# EAGLE design Driver 1 (EAGLE 8.5.1)
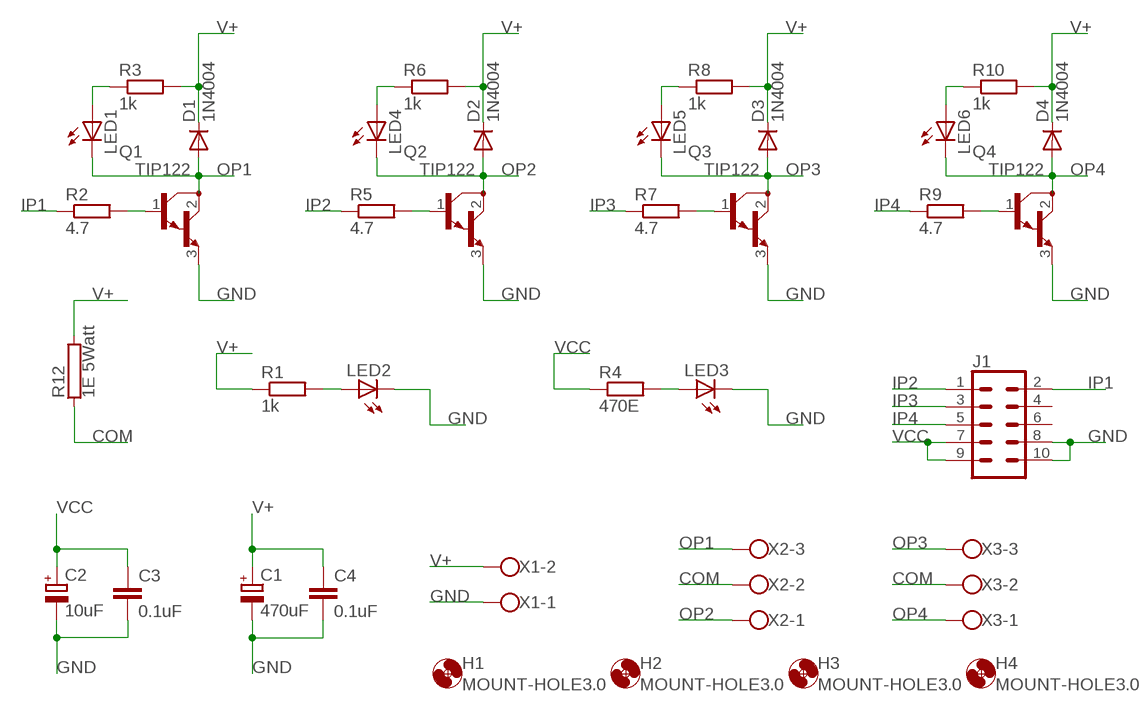
[diagram p0: schematic, sheet 1]

## Parts
C1  470uF  CPOL-EUE5-8.5  [E5-8,5]
C2  10uF  CPOL-EUE2-5  [E2-5]
C3  0.1uF  C-EU025-025X050  [C025-025X050]
C4  0.1uF  C-EU025-025X050  [C025-025X050]
D1  1N4004  [DO41-10]
D2  1N4004  [DO41-10]
D3  1N4004  [DO41-10]
D4  1N4004  [DO41-10]
H1  MOUNT-HOLE3.0  [3,0]
H2  MOUNT-HOLE3.0  [3,0]
H3  MOUNT-HOLE3.0  [3,0]
H4  MOUNT-HOLE3.0  [3,0]
J1  CONN_05X2RAF  [2X5-RAF]
LED1  LED5MM  [LED5MM]
LED2  LED5MM  [LED5MM]
LED3  LED5MM  [LED5MM]
LED4  LED5MM  [LED5MM]
LED5  LED5MM  [LED5MM]
LED6  LED5MM  [LED5MM]
Q1  TIP122  [TO220]
Q2  TIP122  [TO220]
Q3  TIP122  [TO220]
Q4  TIP122  [TO220]
R1  1k  R-EU_0207/10  [0207/10]
R2  4.7  R-EU_0207/10  [0207/10]
R3  1k  R-EU_0207/10  [0207/10]
R4  470E  R-EU_0207/10  [0207/10]
R5  4.7  R-EU_0207/10  [0207/10]
R6  1k  R-EU_0207/10  [0207/10]
R7  4.7  R-EU_0207/10  [0207/10]
R8  1k  R-EU_0207/10  [0207/10]
R9  4.7  R-EU_0207/10  [0207/10]
R10  1k  R-EU_0207/10  [0207/10]
R12  1E 5Watt  RKH208-8  [KH208-8]
X1  W237-102  [W237-102]
X2  W237-103  [W237-103]
X3  W237-103  [W237-103]

## Nets
COM: R12.1 X2.2 X3.2
GND: C1.- C2.- C3.2 C4.2 J1.8 J1.10 LED2.K(C) LED3.K(C) Q1.3(E) Q2.3(E) Q3.3(E) Q4.3(E) X1.1
IP1: J1.2 R2.1
IP2: J1.1 R5.1
IP3: J1.3 R7.1
IP4: J1.5 R9.1
N$1: LED2.A R1.2
N$2: LED1.A R3.1
N$4: Q1.1(B) R2.2
N$6: LED4.A R6.1
N$7: LED3.A R4.2
N$9: Q2.1(B) R5.2
N$11: LED5.A R8.1
N$13: Q3.1(B) R7.2
N$15: LED6.A R10.1
N$17: Q4.1(B) R9.2
OP1: D1.A LED1.K(C) Q1.2(C) X2.3
OP2: D2.A LED4.K(C) Q2.2(C) X2.1
OP3: D3.A LED5.K(C) Q3.2(C) X3.3
OP4: D4.A LED6.K(C) Q4.2(C) X3.1
V+: C1.+ C4.1 D1.C D2.C D3.C D4.C R1.1 R3.2 R6.2 R8.2 R10.2 R12.2 X1.2
VCC: C2.+ C3.1 J1.7 J1.9 R4.1
Unconnected: J1.4 J1.6

## Library data of the parts
C1 C2 = rcl:CPOL-EU: POLARIZED CAPACITOR, European symbol; SPICEPREFIX: C
C3 C4 = rcl:C-EU: CAPACITOR, European symbol; SPICEPREFIX: C
D1-D4 = adafruit:1N4004: DIODE General purpose 1N400x type rectifier (With bigger pads) http://www.ladyada.net/library/pcb/eaglelibrary.html
H1-H4 = holes:MOUNT-HOLE: MOUNTING HOLE with drill center marker
J1 = SparkFun-Connectors:CONN_05X2: Multi connection point. Often used as Generic Header-pin footprint for 0.1 inch spaced/style header connections For AVR SPI programming port, see special device with nice symbol: "AVR_SPI_PROG_5x2.dev" You can populate with any combo of single row headers, but if you'd like an exact match, check these: 2x5 AVR ICSP Male Header <https://www.sparkfun.com/products/778> (PRT-00778) 2x5 Pin Shrouded Header <https://www.sparkfun.com/products/8506> (PRT-08506) On any of the 0.1 inch spaced packages, you can populate with these: Break Away Headers - Straight <https://www.sparkfun.com/products/116> (PRT-00116) Break Away Male Headers - Right Angle <https://www.sparkfun.com/products/553> (PRT-00553) Female Headers <https://www.sparkfun.com/products/115> (PRT-00115) Break Away Headers - Machine Pin <https://www.sparkfun.com/products/117> (PRT-00117) Break Away Female Headers - Swiss Machine Pin <https://www.sparkfun.com/products/743> (PRT-00743) Special note: the shrouded connector mates well with our 5x2 ribbon cables: 2x5 Pin IDC Ribbon Cable <https://www.sparkfun.com/products/8535> (PRT-08535)
LED1-LED6 = adafruit:LED: LED OSRAM: - CHIPLED LG R971, LG N971, LY N971, LG Q971, LY Q971, LO R971, LY R971 LH N974, LH R974 LS Q976, LO Q976, LY Q976 LO Q996 - Hyper CHIPLED LW Q18S LB Q993, LB Q99A, LB R99A - SideLED LS A670, LO A670, LY A670, LG A670, LP A670 LB A673, LV A673, LT A673, LW A673 LH A674 LY A675 LS A676, LA A676, LO A676, LY A676, LW A676 LS A679, LY A679, LG A679 - Hyper Micro SIDELED® LS Y876, LA Y876, LO Y876, LY Y876 LT Y87S - SmartLED LW L88C, LW L88S LB L89C, LB L89S, LG L890 LS L89K, LO L89K, LY L89K LS L896, LA L896, LO L896, LY L896 - TOPLED LS T670, LO T670, LY T670, LG T670, LP T670 LSG T670, LSP T670, LSY T670, LOP T670, LYG T670 LG T671, LOG T671, LSG T671 LB T673, LV T673, LT T673, LW T673 LH T674 LS T676, LA T676, LO T676, LY T676, LB T676, LH T676, LSB T676, LW T676 LB T67C, LV T67C, LT T67C, LS T67K, LO T67K, LY T67K, LW E67C LS E67B, LA E67B, LO E67B, LY E67B, LB E67C, LV E67C, LT E67C LW T67C LS T679, LY T679, LG T679 LS T770, LO T770, LY T770, LG T770, LP T770 LB T773, LV T773, LT T773, LW T773 LH T774 LS E675, LA E675, LY E675, LS T675 LS T776, LA T776, LO T776, LY T776, LB T776 LHGB T686 LT T68C, LB T68C - Hyper Mini TOPLED® LB M676 - Mini TOPLED Santana® LG M470 LS M47K, LO M47K, LY M47K Source: http://www.osram.convergy.de/
Q1-Q4 = transistor-npn:TIP122*: NPN Darlington Transistor
R1-R10 = rcl:R-EU_: RESISTOR, European symbol; SPICEPREFIX: R
R12 = resistor-power:R: Power Resitor; OC_FARNELL: unknown; OC_NEWARK: unknown
X1 = con-wago-500:W237-102: WAGO SCREW CLAMP; MPN: 237-102; OC_FARNELL: unknown; OC_NEWARK: 70K9898
X2 X3 = con-wago-500:W237-103: WAGO SCREW CLAMP; MPN: 237-103; OC_FARNELL: unknown; OC_NEWARK: 18M7116

## Board
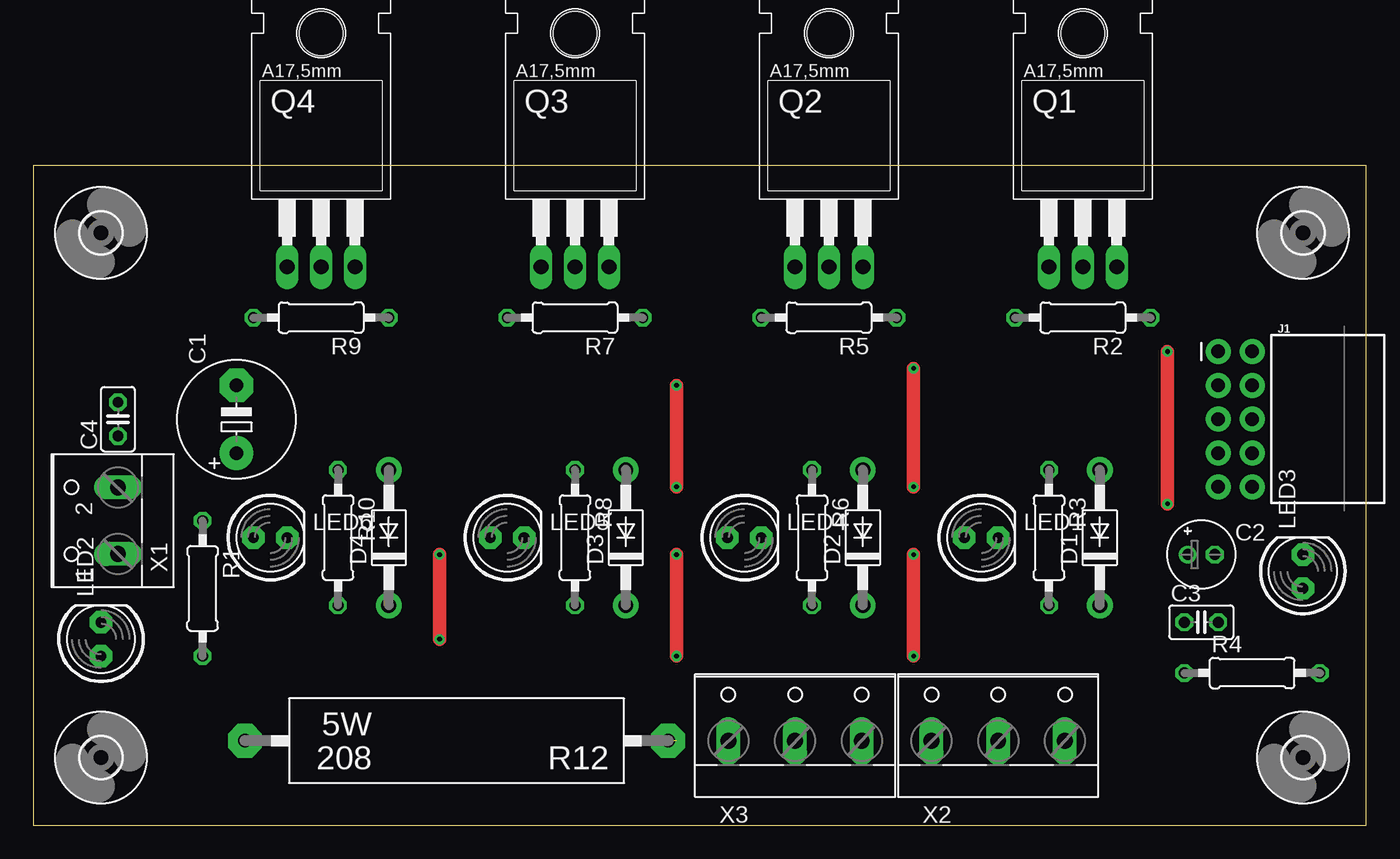
[diagram p1: board, top side]
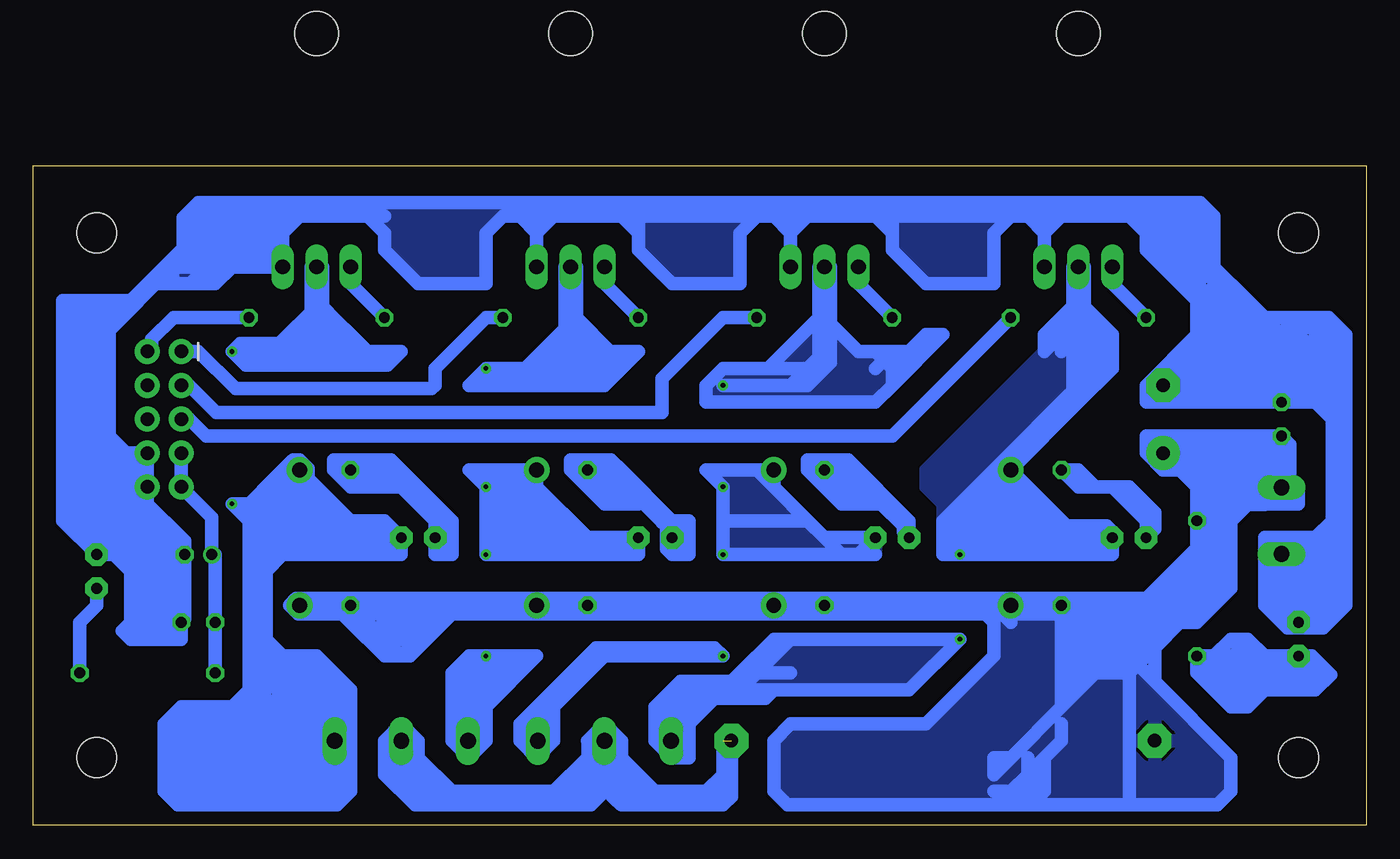
[diagram p2: board, bottom side, seen from below]

Size 100 x 49.52 mm. Coordinates in mm from the lower left corner, seen from the top.
Outline: 0,0 100,0 100,49.52 0,49.52 0,0
Copper layers (1*16): Top 0.035mm / dielectric 1.5mm / Bottom 0.035mm
Design rules "default *": minimum track width 6mil, minimum drill 0.35mm, track to track 30mil, track to pad 30mil, pad to pad 6mil, via to via 6mil, smd to smd 6mil, copper to edge 40mil, drill to drill 6mil, minimum pad ring 10mil, minimum via ring 8mil, stop-mask expansion 4mil, vias tented up to drill 0mil, thermal gap 10mil

### Footprints (pad centres in the part's own frame; a part is rotated, then mirrored left to right if it is on the bottom)
E5-8,5 = drill 1.016 pad 2.54: + -2.54,0 | drill 1.016 pad 2.54 octagon: - 2.54,0
E2-5 = drill 0.813 pad 1.27: + -1.016,0 | drill 0.813 pad 1.27 octagon: - 1.016,0
C025-025X050 = drill 0.813 octagon: 1 -1.27,0; 2 1.27,0
DO41-10 = drill 1.118 pad 1.93: A 5.08,0; C -5.08,0
3,0 = hole 3: 0,0
2X5-RAF = drill 1.016 pad 1.88: 1 -1.27,5.08; 2 1.27,5.08; 3 -1.27,2.54; 4 1.27,2.54; 5 -1.27,0; 6 1.27,0; 7 -1.27,-2.54; 8 1.27,-2.54; 9 -1.27,-5.08; 10 1.27,-5.08
LED5MM = drill 0.813 pad 1.676 octagon: A -1.27,0; K 1.27,0
TO220 = drill 1.118 long: 1 -2.54,-6.35; 2 0,-6.35; 3 2.54,-6.35 | hole 3.302: 0,11.176
0207/10 = drill 0.813 octagon: 1 -5.08,0; 2 5.08,0
KH208-8 = drill 1.016 pad 2.54 octagon: 1 -15.875,0; 2 15.875,0
W237-102 = drill 1.194 long: 1 -2.5,-1.27; 2 2.5,-1.27
W237-103 = drill 1.194 long: 1 -5,-1.29; 2 0,-1.29; 3 5,-1.29

### Placement (x,y rotation side)
C1  15.24,30.48 90 top
C2  87.63,20.32 0 top
C3  87.63,15.24 0 top
C4  6.35,30.48 90 top
D1  80.01,21.59 90 top
D2  62.23,21.59 90 top
D3  44.45,21.59 90 top
D4  26.67,21.59 90 top
H1  95.25,5.08 0 top
H2  5.08,44.45 0 top
H3  95.25,44.45 0 top
H4  5.08,5.08 0 top
J1  90.17,30.48 0 top
LED1  71.12,21.59 0 top
LED2  5.08,13.97 90 top
LED3  95.25,19.05 90 top
LED4  53.34,21.59 0 top
LED5  35.56,21.59 0 top
LED6  17.78,21.59 0 top
Q1  78.74,48.26 0 top
Q2  59.69,48.26 0 top
Q3  40.64,48.26 0 top
Q4  21.59,48.26 0 top
R1  12.7,17.78 270 top
R2  78.74,38.1 180 top
R3  76.2,21.59 270 top
R4  91.44,11.43 0 top
R5  59.69,38.1 180 top
R6  58.42,21.59 270 top
R7  40.64,38.1 180 top
R8  40.64,21.59 270 top
R9  21.59,38.1 180 top
R10  22.86,21.59 270 top
R12  31.75,6.35 180 top
X1  5.08,22.86 90 top
X2  72.39,7.62 0 top
X3  57.15,7.62 0 top

### Tracks (layer width: path | path; a pad name or v marks a point on that pad's centre or on a via)
COM  (1 unrouted)
  Bottom 1.016: 48.26,3.81 48.26,6.35 47.62,6.99 47.62,2.16 48.26,1.52 49.28,1.52 | 48.26,3.81 48.26,2.54 49.28,1.52 | 49.28,1.52 55.88,1.52 56.39,2.03 | 56.39,2.03 56.9,2.54 | 56.9,2.54 57.15,2.54 | 72.39,3.81 72.39,2.79 | 72.14,2.54 71.12,1.52 | 71.12,1.52 58.17,1.52 57.15,2.54 | 48.26,3.81 49.53,2.54 53.34,2.54 | 53.34,2.54 54.61,2.54 | 54.61,2.54 55.88,2.54 | 55.88,2.54 56.9,2.54 | 57.15,2.54 58.42,2.54 | 58.42,2.54 59.69,2.54 | 59.69,2.54 60.96,2.54 | 60.96,2.54 68.6,2.54 | 68.6,2.54 69.85,2.54 | 69.85,2.54 71.12,2.54 | 71.12,2.54 72.14,2.54 | 72.14,2.54 72.39,2.79 | 72.39,3.81 71.12,2.54 | 71.12,5.08 71.12,3.81 | 71.12,3.81 71.12,2.54 | 72.39,3.81 71.12,3.81 | 71.12,3.81 69.85,2.54 | X2.2 72.39,3.83 | X2.2 71.14,5.08 | 71.14,5.08 71.12,5.08 | 71.14,5.08 72.39,3.83 | 72.39,3.83 72.39,3.81 | X2.2 72.41,6.33 73.66,5.08 | 73.66,5.08 73.66,3.81 | 73.66,5.08 73.64,5.08 72.39,3.83 | 73.66,3.81 73.41,3.81 72.39,2.79 | X2.2 71.14,6.33 | 71.14,6.33 71.12,6.35 | 71.12,6.35 72.41,6.35 | 73.66,6.35 73.66,5.08 | 71.14,6.33 71.14,5.1 71.12,5.08 | 71.12,6.35 72.39,7.62 73.66,6.35 | X2.2 72.41,6.35 | 72.41,6.35 73.66,6.35 | 55.88,5.08 55.88,3.81 | 55.88,3.81 55.88,2.54 | X3.2 57.15,5.08 | 57.15,3.81 57.15,2.54 | 56.39,2.03 56.39,4.32 57.15,5.08 | X3.2 57.13,6.33 55.88,5.08 | 55.88,5.08 55.88,6.35 57.15,7.62 58.42,6.35 58.4,6.33 | 58.4,6.33 57.15,5.08 | X3.2 57.17,6.33 58.4,5.1 | 58.4,5.1 58.4,6.33 | 58.4,5.1 60.96,2.54 | X3.2 58.42,5.06 | 58.42,5.06 58.42,3.81 | 58.42,3.81 59.69,2.54 | 71.14,5.08 68.6,2.54 | 73.66,3.81 71.37,1.52 71.12,1.52 | 58.42,2.54 57.15,3.81 | 57.15,3.81 57.15,5.08 | 58.42,5.06 57.17,3.81 | 57.17,3.81 57.15,3.81 | 55.88,5.08 53.34,2.54 | 55.88,3.81 54.61,2.54 | 57.17,3.81 58.42,3.81
GND
  Bottom 1.016: 24.13,45.72 24.13,44.45 | 24.13,44.45 Q4.3 | 24.13,45.72 25.4,45.72 | 25.4,45.72 26.67,45.72 | 26.67,45.72 35.56,45.72 | 35.56,45.72 36.83,45.72 | 36.83,45.72 41.91,45.72 | 41.91,45.72 43.18,45.72 | 43.18,45.72 44.45,45.72 | 44.45,45.72 45.72,45.72 | 45.72,45.72 54.61,45.72 | 54.61,45.72 55.88,45.72 | 55.88,45.72 60.96,45.72 | 60.96,45.72 62.23,45.72 | 62.23,45.72 62.23,44.45 | 62.23,44.45 Q2.3 | Q3.3 43.18,44.45 | 43.18,44.45 43.18,45.72 | 81.28,45.72 80.01,45.72 | 74.93,45.72 80.01,45.72 | 63.5,45.72 64.77,45.72 66.04,44.45 66.04,40.64 71.12,40.64 73.66,43.18 73.66,44.45 74.93,45.72 | 63.5,45.72 62.23,45.72 | 86.99,41.91 86.36,41.91 | 86.36,41.91 85.09,41.91 | 85.09,41.91 82.55,41.91 | 82.55,41.91 Q1.3 81.28,43.18 | X1.1 5.08,19.09 | 5.08,19.09 3.77,19.09 | 3.77,19.09 2.54,20.32 | 2.54,21.59 2.54,22.86 | 2.54,22.86 2.54,30.48 | 2.54,30.48 2.54,31.75 | 2.54,33.02 2.54,34.04 | 2.54,34.29 2.54,35.56 | 2.54,35.56 2.54,36.83 3.81,34.29 | 2.54,33.02 2.54,31.75 | 5.08,17.82 5.08,19.09 | 3.77,19.09 4.45,18.41 4.48,18.41 5.08,17.82 | 5.08,17.82 X1.1 | 6.35,17.78 7.62,17.78 | 7.62,21.59 6.35,21.59 | 6.35,21.59 3.81,21.59 | 3.81,21.59 3.17,20.95 | 3.17,20.95 2.54,20.32 | 2.54,20.32 2.54,21.59 | X1.1 5.04,19.09 2.54,20.32 | X1.1 6.35,21.59 | 7.62,17.82 7.62,19.05 | 7.62,19.05 7.62,21.59 | X1.1 7.58,19.09 7.62,19.05 | X1.1 6.35,17.78 | X1.1 7.62,17.82 | 7.62,17.82 7.62,17.78 | X1.1 6.39,19.09 7.62,21.59 | X1.1 6.31,19.09 5.08,20.32 | 5.08,20.32 3.81,21.59 | 2.54,20.32 1.52,21.34 | 1.52,34.54 1.91,34.92 | 1.52,34.54 2.54,33.02 | 1.52,21.34 1.52,34.54 | 11.43,39.37 10.16,36.83 | 10.16,36.83 8.89,34.29 | 8.89,34.29 6.98,34.92 | 6.98,34.92 7.62,33.02 | 11.43,39.37 11.43,40.64 | 11.43,44.45 11.43,45.72
  Bottom 1.016: 11.43,45.72 12.7,45.72 | 12.7,45.72 13.97,45.72 | 13.97,45.72 15.24,45.72 | 15.24,45.72 16.51,45.72 | 16.51,45.72 17.78,45.72 | 17.78,45.72 22.86,45.72 | 22.86,45.72 24.13,45.72 | 11.43,45.72 12.44,46.73 80.27,46.73 | 80.27,46.73 81.28,45.72 | 81.28,45.72 82.55,44.45 | 82.55,44.45 82.55,43.18 | 82.55,43.18 82.55,42.55 | 82.55,42.55 82.55,41.91 | 81.28,43.18 81.28,44.45 | 81.28,44.45 81.28,45.72 | 81.91,43.81 81.28,43.18 | 82.55,41.91 81.91,42.55 | 81.91,42.55 81.28,43.18 | 81.28,44.45 81.91,43.81 | 81.91,43.81 81.91,42.55 | 80.01,45.72 81.28,44.45 | 62.23,44.45 63.5,45.72 | 62.23,44.45 60.96,45.72 | 43.18,44.45 44.45,45.72 | 43.18,44.45 41.91,45.72 | 24.13,44.45 25.4,45.72 | 24.13,44.45 22.86,45.72 | 12.7,45.72 12.7,44.45 | 3.81,34.29 2.54,31.75 | 12.7,36.83 12.7,35.56 | 10.16,34.29 8.89,34.29 | 3.81,34.29 2.54,34.29 | 10.16,35.56 8.89,34.29 | 6.98,32.38 C4.2 | 7.62,33.02 8.89,33.02 | 12.06,33.66 12.7,34.29 | 6.98,32.38 10.79,32.38 | 10.79,32.38 11.43,33.02 | 10.16,34.29 9.53,33.66 | 9.53,33.66 8.89,33.02 | 10.16,34.29 11.43,34.29 | 8.89,33.02 11.43,33.02 | 11.43,33.02 10.16,34.29 | 9.53,33.66 12.06,33.66 | 5.71,33.66 4.45,32.38 | 4.45,32.38 3.81,31.75 | 3.81,31.75 2.54,30.48 | 5.08,34.29 2.54,31.75 | 11.43,35.56 10.16,34.29 | 3.81,35.56 3.17,34.92 | 3.17,34.92 2.54,34.29 | 7.62,34.29 8.89,35.56 | 8.89,35.56 7.62,35.56 | 7.62,35.56 6.35,34.29 | 5.08,34.29 3.81,35.56 | 5.71,34.92 3.17,34.92 | 2.54,33.02 3.17,34.92 | 3.17,34.92 3.81,34.29 | 7.62,33.02 7.62,34.29 | 6.35,34.29 5.08,34.29 | 5.08,34.29 2.54,33.02 | 6.98,32.38 7.62,33.02 | 3.81,34.29 5.71,33.66 | 5.71,33.66 6.35,34.29 | 2.54,35.56 3.81,36.83 | 3.81,35.56 3.81,34.29 | 3.81,35.56 5.08,36.83 | 5.08,36.83 3.81,34.29 | 3.81,35.56 3.81,36.83
  Bottom 1.016: 5.08,35.56 6.35,36.83 C4.2 | 6.35,35.56 7.62,36.83 | 7.62,35.56 8.89,33.02 | 8.89,34.29 9.53,33.66 | 7.62,35.56 7.62,36.83 | 7.62,36.83 8.89,34.29 | 5.08,36.83 7.62,36.83 | 5.08,36.83 6.05,32.95 | 6.05,32.95 C4.2 | C4.2 8.89,33.02 | 7.62,36.83 C4.2 | 7.62,35.56 8.89,36.83 | 8.89,36.83 11.43,33.02 | 11.43,33.02 11.43,34.29 | 11.43,34.29 9.53,33.66 | 8.89,35.56 8.89,36.83 | 8.89,35.56 8.89,34.29 | 8.89,34.29 12.7,35.56 | 11.43,33.02 12.06,33.66 | 8.89,36.83 10.16,36.83 | 10.16,36.83 11.18,36.32 | 11.18,36.32 12.7,35.56 | 10.16,35.56 12.7,34.29 | 12.7,34.29 11.43,34.29 | 11.43,34.29 8.89,35.56 | 8.89,35.56 11.43,35.56 | 11.43,35.56 12.7,36.83 | 12.7,39.37 12.7,40.64 | 12.7,40.64 12.7,41.91 | 12.7,41.91 12.7,43.18 | 12.7,43.18 12.06,43.81 | 12.06,43.81 11.43,44.45 | 11.43,44.45 11.43,41.91 | 11.43,41.91 11.43,40.64 | 11.43,39.37 11.94,38.35 | 11.94,38.35 12.7,36.83 | 11.43,41.91 12.7,40.64 | 12.06,43.81 12.06,42.55 | 12.06,42.55 12.7,41.91 | 11.43,45.72 12.7,44.45 | 16.51,44.45 16.51,43.18 12.7,39.37 | 16.51,44.45 16.51,45.72 | 16.51,44.45 13.33,41.27 | 13.33,41.27 12.7,40.64 | 13.33,41.27 13.33,42.55 16.51,45.72 | 15.24,45.72 13.97,44.45 | 13.97,44.45 12.7,44.45 | 13.97,45.72 12.7,44.45 | 13.97,44.45 12.7,43.18 | 26.67,45.72 27.94,44.45 27.94,40.64 33.02,40.64 35.56,43.18 35.56,44.45 | 35.56,44.45 35.56,45.72 | 45.72,45.72 46.99,44.45 46.99,40.64 52.07,40.64 54.61,43.18 54.61,44.45 | 54.61,44.45 54.61,45.72 | 80.27,46.73 87.63,46.73 88.77,45.59 | 74.93,45.72 73.66,45.72 | 54.61,44.45 55.88,45.72 | 35.56,44.45 36.83,45.72 | 16.51,44.45 17.78,45.72 | 87.63,45.72 88.77,45.59 | J1.8 91.44,26.67 | 91.44,26.67 J1.10 | 91.44,24.13 88.9,21.59 | 88.9,21.59 88.65,21.34 C2.- 88.65,19.05
  Bottom 1.016: 88.65,19.05 88.65,15.49 C3.2 | 88.9,13.97 C3.2 | 92.71,15.24 93.34,14.61 | 92.71,15.24 92.71,16.51 | 92.71,16.51 92.71,17.78 | 92.71,17.78 92.71,19.05 | 92.71,20.32 92.71,19.05 | 92.71,19.05 93.98,20.32 | 93.98,20.32 LED3.K | 1.91,34.92 3.81,34.29 | 3.81,34.29 5.08,34.29 | 6.35,34.29 7.62,34.29 | 7.62,34.29 8.89,34.29 | 6.98,34.92 5.71,34.92 | 94.3,35.88 94.93,35.24 | 94.93,35.24 97.47,32.7 | 97.47,32.7 97.79,32.38 | 97.79,38.1 97.79,36.83 | 97.79,36.83 97.79,35.88 | 93.34,38.1 93.98,38.1 | 93.98,38.1 97.79,38.1 | 90.49,40.96 89.53,41.91 89.53,40.64 90.8,40.64 | 90.49,40.96 90.8,40.64 | 90.8,40.64 93.34,38.1 | 86.99,41.91 87.95,40.96 86.68,40.96 86.36,40.64 | 85.09,41.91 86.36,40.64 | 86.36,41.91 86.36,40.64 | 94.3,35.88 94.3,29.21 93.03,27.94 J1.8 | 86.36,40.64 90.17,40.64 90.49,40.96 | 90.49,40.96 91.12,40.96 | 91.12,40.96 92.71,39.37 | 92.71,39.37 93.34,38.73 | 93.34,38.73 93.98,38.1 | 97.79,38.1 97.79,39.37 92.71,39.37 | 93.34,38.1 94.3,37.15 | 94.3,37.15 94.3,35.88 | 81.28,45.72 82.55,45.72 | 82.55,45.72 87.63,45.72 | 87.63,45.72 88.27,45.09 | 88.27,45.09 87.63,43.18 | 87.63,43.18 88.9,43.18 | 88.9,43.18 88.9,41.91 86.99,41.91 | 82.55,44.45 83.19,45.09 88.27,45.09 | 88.27,45.09 87.63,44.45 | 87.63,44.45 86.99,43.81 | 81.91,43.81 82.55,44.45 | 82.55,44.45 87.63,44.45 | 86.99,43.81 86.36,43.81 | 86.36,43.81 85.09,43.81 | 85.09,43.81 83.82,43.81 | 83.82,43.81 83.19,43.81 82.55,43.18 | 81.91,42.55 82.55,42.55 | 82.55,42.55 83.82,42.55 | 83.82,42.55 85.09,42.55 | 85.09,42.55 86.99,42.55 | 86.99,42.55 88.27,42.55 88.9,43.18 | 83.82,43.81 82.55,42.55 | 83.82,42.55 85.09,43.81 | 86.36,43.81 86.04,43.5 | 86.04,43.5 85.09,42.55 | 87.63,43.18 86.99,42.55 | 86.36,43.81 86.99,43.18 86.99,42.55
  Bottom 1.016: 91.12,40.96 88.9,43.18 | 93.34,38.73 97.16,38.73 97.79,38.1 | LED3.K 97.79,22.86 97.79,24.13 | 97.79,32.38 97.79,30.48 | 97.79,30.48 97.79,29.21 | 97.79,26.67 97.79,24.13 | 87.63,43.18 88.7,44.45 88.07,43.81 86.99,43.81 | 88.77,45.59 88.77,43.31 88.9,43.18 | 91.44,13.97 92.71,13.97 93.34,14.61 | 91.44,13.97 90.17,13.97 | 90.17,13.97 88.9,13.97 | 1.52,34.54 1.52,35.31 | 1.91,34.92 1.52,35.31 | 1.52,35.31 1.52,35.56 | 1.52,35.56 2.54,35.56 | 8.89,36.83 10.81,40.28 | 10.81,40.28 12.06,42.55 | 2.54,35.56 3.81,35.56 | 3.81,35.56 5.08,35.56 | 11.43,40.64 8.89,35.56 | 7.62,35.56 6.35,35.56 | 5.08,35.56 3.81,34.29 | 1.52,35.56 2.54,34.04 | 2.54,34.04 2.54,34.29 | 1.52,35.56 3.3,37.34 | 3.3,37.34 3.81,37.85 3.81,36.83 | 7.62,34.29 6.98,37.47 | 6.98,37.47 6.35,35.56 | 6.35,35.56 5.08,35.56 | 5.08,34.29 5.71,34.92 | 5.71,34.92 6.35,35.56 | 6.98,37.47 6.6,36.7 | 6.6,36.7 5.71,34.92 | 94.3,37.15 95.25,37.15 | 95.25,37.15 96.52,37.15 | 96.52,37.15 97.47,37.15 97.79,36.83 | 96.52,37.15 97.79,35.88 | 97.79,35.88 97.79,35.56 | 97.79,35.56 97.79,34.29 | 97.79,34.29 97.79,32.38 | 95.25,37.15 95.25,35.24 | 95.25,35.24 95.25,33.02 | 95.25,26.67 95.25,25.4 | 95.25,24.13 95.25,22.86 | 95.25,22.86 95.25,21.59 | 95.25,21.59 LED3.K | 96.52,22.86 95.25,21.59 | 95.25,37.15 95.41,36.99 | 95.41,36.99 96.84,35.56 97.79,35.56 | 94.93,35.24 95.25,35.24 | 95.25,35.24 96.84,35.24 97.16,34.92 | 97.16,34.92 97.79,34.29 | 97.47,32.7 97.47,33.02 96.36,34.13 | 96.36,34.13 95.25,35.24 | 95.25,35.24 95.41,35.4 95.41,36.99 | 96.52,37.15 96.52,33.02 | 96.52,33.02 96.52,31.75 | 96.52,31.75 96.52,30.48 | 96.52,24.13 96.52,22.86 | 95.25,33.02 96.36,34.13 | 97.16,34.92 97.16,31.11 96.52,30.48 | 97.79,29.21 97.16,29.84
  Bottom 1.016: 97.16,29.84 96.52,30.48 | 96.52,30.48 96.52,29.21 | 96.52,29.21 96.52,27.94 | 96.52,27.94 96.52,25.4 | 96.52,25.4 96.52,24.13 | 96.52,24.13 95.25,22.86 | 95.25,33.02 95.25,31.75 | 95.25,31.75 95.25,30.48 | 95.25,30.48 95.25,29.21 | 95.25,29.21 95.25,27.94 | 95.25,27.94 95.25,26.67 | 95.25,26.67 95.88,26.04 | 95.88,26.04 96.52,25.4 | 96.52,33.02 95.25,31.75 | 96.52,30.48 95.25,29.21 | 96.52,31.75 95.25,30.48 | 96.52,27.94 95.88,27.3 | 95.88,27.3 95.25,26.67 | 96.52,29.21 95.25,27.94 | 97.79,29.21 97.79,26.67 | 97.79,26.67 97.16,26.04 | 96.52,25.4 95.25,24.13 | 97.16,29.84 97.16,26.04 | 97.16,26.04 96.52,25.4 | 97.79,24.13 96.52,22.86 | 97.16,26.04 97.16,24.77 | 97.16,24.77 96.52,24.13 | 95.25,29.21 93.34,27.3 | 93.34,27.3 92.71,26.67 | 92.71,26.67 91.44,26.67 | J1.8 92.08,27.3 | 92.08,27.3 92.71,26.67 | 95.25,27.94 92.71,25.4 | 92.71,25.4 J1.10 | 92.71,26.67 J1.10 | J1.10 91.44,24.13 | 95.25,26.67 92.71,24.13 | 92.71,24.13 91.44,24.13 | J1.10 92.71,24.13 | 92.71,24.13 90.17,21.59 | 90.17,21.59 88.9,21.59 | 95.25,25.4 95.25,24.13 | 95.25,24.13 92.71,21.59 | 92.71,21.59 91.44,21.59 | 91.44,21.59 90.17,21.59 | 95.25,25.4 91.44,21.59 | 95.25,22.86 93.34,20.95 | 93.34,20.95 92.71,20.32 | 95.25,21.59 93.98,20.32 | 92.71,20.32 91.44,21.59 | 91.44,21.59 90.17,20.32 | 90.17,20.32 88.9,20.32 | 88.9,20.32 88.9,19.05 | 88.9,19.05 88.65,19.05 | 90.17,21.59 88.9,20.32 | 88.9,19.05 88.9,17.78 | 90.17,20.32 90.17,19.05 | 90.17,19.05 90.17,17.78 | 90.17,17.78 90.17,15.24 | 90.17,15.24 90.17,13.97 | 88.9,13.97 90.17,15.24 | C3.2 88.9,16.51 | 88.9,16.51 88.9,17.78 | 88.9,17.78 90.17,19.05 | 90.17,20.32 88.9,19.05 | 90.17,17.78 88.9,16.51 | 92.71,20.32 91.44,20.32 | 91.44,20.32 90.17,19.05 | 92.71,20.32 90.17,17.78
  Bottom 1.016: 92.71,19.05 C3.2 | 92.71,17.78 90.17,15.24 | 92.71,16.51 91.44,15.24 | 91.44,15.24 90.17,15.24 | 93.34,14.61 92.08,14.61 91.44,15.24 | 92.71,15.24 91.44,15.24 | 91.44,15.24 90.17,13.97 | 91.44,13.97 91.44,15.24 | 91.44,20.32 91.44,21.59 | 92.71,21.59 93.34,20.95 | 92.71,24.13 92.71,25.4 | 96.52,24.13 95.25,25.4 | 97.79,24.13 97.16,24.77 | 95.88,27.3 95.88,26.04 | 92.08,27.3 93.34,27.3 | 97.16,29.84 97.79,30.48 | 97.79,30.48 96.52,30.48 | 87.63,43.18 86.36,43.18 86.04,43.5 | 82.55,44.45 82.55,45.72 | 12.7,40.64 11.43,39.37 | 3.17,34.92 5.71,33.66 | C4.2 3.81,31.75 | 4.45,32.38 5.49,32.38 6.05,32.95 | 1.52,35.56 1.52,36.83 2.79,38.1 7.62,38.1 12.7,43.18 | 12.7,43.18 12.7,44.45 | 3.3,37.34 5.97,37.34 6.6,36.7 | 7.62,36.83 8.89,38.1 | 8.89,38.1 10.81,40.02 10.81,40.28 | 6.6,36.7 8,38.1 8.89,38.1 | 12.7,39.37 11.18,37.85 11.18,36.32 | 12.7,36.83 10.16,36.83 | 10.16,35.56 11.94,37.34 11.94,38.35 | 12.7,39.37 12.7,36.83 | 12.7,35.56 13.97,34.29 | 13.97,34.29 12.7,34.29 | 12.7,36.83 16.51,33.02 | 16.51,33.02 16.51,31.75 | 16.51,31.75 13.97,31.75 | 13.97,31.75 12.7,31.75 | 12.7,31.75 C4.2 | 1.52,21.34 1.52,16.51 2.54,15.49 | 2.54,15.49 3.23,14.81 5.08,14.81 | 7.62,17.78 7.62,16.51 5.92,14.81 5.08,14.81 | 3.81,21.59 2.54,21.59 | 5.08,17.82 5.12,17.78 6.35,17.78 | 3.17,20.95 3.81,20.32 5.08,20.32 | 6.35,21.59 5.08,20.32 | 7.62,17.82 6.33,16.53 | 6.33,16.53 5.08,15.28 | 5.08,15.28 5.08,14.81 | 2.54,20.32 2.54,19.05 | 2.54,19.05 2.54,17.78 | 2.54,17.78 2.54,16.51 | 2.54,16.51 2.54,15.49 | 2.54,16.51 3.77,15.28 3.85,15.28 | 3.85,15.28 5.08,15.28 | 6.33,16.53 5.06,16.53 2.54,19.05 | 6.35,17.78 5.71,17.14 | 5.71,17.14 3.85,15.28 | LED2.K 2.54,17.78 | 5.08,17.82 5.08,17.78 5.71,17.14
  Bottom 1.016: 3.81,21.59 2.54,22.86 | 16.51,33.02 C1.- | 13.97,33.02 C1.- | C1.- 13.97,31.75 | C1.- 16.51,31.75 | C1.- 13.97,34.29 | C1.- 12.7,33.02 | 12.7,33.02 11.43,33.02 | 12.7,31.75 12.7,33.02 | 12.7,33.02 12.7,34.29 | 10.79,32.38 13.33,32.38 13.97,31.75 | 13.97,31.75 13.97,34.29 | 12.7,33.02 13.97,34.29 | 12.7,34.29 12.7,35.56
  pour Bottom: 35.56,45.72 35.56,44.45 31.75,40.64 29.21,40.64 27.94,41.91 27.94,45.72
  pour Bottom: 46.99,44.45 46.99,45.72 54.61,45.72 54.61,43.18 53.34,41.91 52.07,40.64 46.99,40.64
  pour Bottom: 64.77,45.72 73.66,45.72 73.66,44.45 69.85,40.64 66.04,40.64 66.04,44.45
  pour Bottom: 80.01,45.72 81.28,44.45 82.55,44.45 82.55,41.91 87.63,41.91 88.9,40.64 87.63,45.72
IP1
  Bottom 1.016: J1.2 91.11,35.89 91.11,36.48 89.48,38.1 R2.1
IP2
  Bottom 1.016: R5.1 66.04,38.1 69.85,34.29 69.85,33.02 70.1,32.77 84.84,32.77 87.63,35.56 J1.1
IP3
  Bottom 1.016: R7.1 48.26,38.1 52.83,33.53 52.83,30.99 86.28,30.99 88.31,33.02 J1.3
IP4
  Bottom 1.016: R9.1 35.56,29.21 87.05,29.21 88.31,30.48 J1.5
N$1
  Bottom 1.016: 11.43,12.7 R1.2 12.7,11.43 | 11.43,12.7 10.16,12.7 | 10.16,12.7 8.89,12.7 | 6.35,12.7 LED2.A | 3.81,11.43 5.08,11.43 | 5.08,11.43 7.62,11.43 | 8.89,11.43 10.16,11.43 | 10.16,11.43 11.43,11.43 | LED2.A 3.81,11.43 | 8.89,12.7 8.26,12.06 | 8.26,12.06 7.62,11.43 | 10.16,12.7 8.89,11.43 | 11.43,12.7 10.16,11.43 | 11.43,12.7 11.43,11.43 | 12.7,11.43 11.43,12.7 | 8.89,12.7 7.62,12.7 | 7.62,12.7 6.35,12.7 | 6.35,12.7 5.71,12.06 | 5.71,12.06 5.08,11.43 | 8.89,11.43 7.62,11.43 | 7.62,11.43 6.35,12.7 | 5.71,12.06 8.26,12.06 | 12.7,11.43 11.43,11.43 | 7.62,10.16 3.81,10.16 2.67,11.3 4.06,12.7 LED2.A | 7.62,10.16 8.89,8.89 | 8.89,8.89 10.16,8.89 | 10.16,8.89 12.7,11.43 | 11.43,11.43 8.89,8.89 | 10.16,11.43 9.53,10.79 | 9.53,10.79 8.89,10.16 | 8.89,10.16 7.62,10.16 | 10.16,8.89 8.89,10.16 | 8.89,10.16 8.89,11.43 | 9.53,10.79 4.45,10.79 3.81,11.43 | 11.43,12.7 10.16,13.97 | 10.16,13.97 8.89,13.97 7.62,12.7 | 10.16,13.97 8.89,12.7
N$2
  Bottom 1.016: R3.1 77.47,26.67 | 72.39,25.4 69.85,22.86 | 77.47,26.67 76.2,25.4 74.93,25.4 | 73.66,25.4 72.39,25.4 | 77.47,26.67 77.47,27.43 74.93,27.43 | 74.93,27.43 74.42,27.43 | 74.42,27.43 72.39,25.4 | 68.58,21.59 68.58,22.86 73.15,27.43 74.42,27.43 | 69.85,22.86 68.58,21.59 | R3.1 74.93,25.4 | 74.93,25.4 73.66,25.4 | 74.93,27.43 74.55,27.05 | 74.55,27.05 73.66,26.16 73.66,25.4 | R3.1 74.93,26.67 | 74.93,25.4 74.55,25.78 74.55,27.05 | 68.58,20.32 68.58,21.59 | 69.85,22.86 LED1.A | LED1.A 68.58,20.32 | 68.58,20.32 69.85,20.32 LED1.A
N$4
  Bottom 1.016: R2.2 76.2,40.64 Q1.1
N$6
  Bottom 1.016: LED4.A 52.5,22.02 | 52.5,22.02 52.5,22.46 52.9,22.86 | 54.39,24.35 55.66,25.62 | 55.66,25.62 56.71,26.67 | 56.71,26.67 R6.1 | LED4.A 50.8,22.86 | 55.88,26.67 56.71,26.67 | R6.1 58.42,25.4 | 58.42,25.4 57.15,24.13 55.88,24.13 | 55.88,24.13 54.61,24.13 54.39,24.35 | 58.42,25.4 59.69,26.67 | 59.69,26.67 59.69,27.43 56.64,27.43 55.88,26.67 | R6.1 59.69,26.67 | R6.1 56.71,24.96 | 56.71,26.67 56.71,24.96 | 56.71,24.96 56.52,24.77 | 56.52,24.77 55.88,24.13 | 55.66,25.62 56.52,24.77 | 55.66,25.62 55.66,24.35 55.88,24.13 | LED4.A 52.07,20.32 | 52.07,20.32 52.5,20.75 52.5,21.59 | 52.5,21.59 52.5,22.02 | 50.8,20.32 50.8,22.86 | 52.07,20.32 50.8,20.32 | LED4.A 52.5,21.59 | LED4.A 50.8,20.32 | 50.8,22.86 52.07,22.86 | 52.07,22.86 52.9,22.86 | 52.9,22.86 54.39,24.35 | 52.07,22.86 55.88,26.67
N$7
  Bottom 1.016: LED3.A 95.25,16.51 96.52,15.24 R4.2
N$9
  Bottom 1.016: R5.2 57.15,40.64 Q2.1
N$11
  Bottom 1.016: 36.39,24.13 37.24,24.99 | 37.24,24.99 38.51,26.26 | 38.51,26.26 38.93,26.67 R8.1 | R8.1 40.64,27.43 | 40.64,27.43 38.86,27.43 34.29,22.86 LED5.A 34.72,22.02 34.72,22.46 36.39,24.13 | 41.5,26.26 41.91,26.67 | 41.91,26.67 41.91,27.43 40.64,27.43 | 41.91,26.67 R8.1 | 38.51,26.26 39.37,26.26 | 39.37,26.26 41.5,26.26 | 41.5,26.26 39.37,24.13 38.1,24.13 | 38.1,24.13 36.39,24.13 | R8.1 38.1,24.13 | 39.37,26.26 38.1,24.99 37.24,24.99
N$13
  Bottom 1.016: R7.2 38.1,40.64 Q3.1
N$15
  Bottom 1.016: 19.05,25.4 17.78,25.4 15.88,23.5 15.88,22.23 LED6.A 16.51,22.86 19.05,25.4 | 20.32,25.4 21.59,26.67 R10.1 21.59,25.4 20.32,25.4 | 20.32,25.4 19.05,25.4
N$17
  Bottom 1.016: R9.2 19.05,40.64 Q4.1
OP1  (via drill 0.35)
  Top 1.016: v85.09,35.56 v85.09,24.13
  Bottom 1.016: X2.3 77.39,7.54 | D1.A 80.01,25.4 | 80.01,25.4 80.64,24.77 | 80.64,24.77 81.28,24.13 | 81.28,24.13 82.55,24.13 | 82.55,24.13 83.82,24.13 | 83.82,24.13 v85.09,24.13 84.45,23.5 | D1.A 79.38,26.04 | 79.38,26.04 78.74,25.4 | 78.74,25.4 76.2,22.86 | 76.2,22.86 75.56,22.23 | 75.56,22.23 74.93,21.59 | 73.66,21.59 74.93,21.59 | 77.39,7.54 77.47,7.54 | 77.47,7.54 78.74,7.62 | 78.74,7.62 79.38,8.26 | 79.38,8.26 80.01,8.89 | 80.01,8.89 80.64,9.53 | 78.74,12.7 76.2,10.16 76.2,8.89 | 76.2,8.89 76.2,7.62 | 76.2,7.62 76.2,6.35 | 76.2,6.35 76.2,5.08 | 76.2,5.08 77.47,5.08 | 77.47,5.08 78.74,5.08 | 78.74,5.08 78.74,6.35 | 78.74,6.35 78.74,7.62 | 83.82,24.13 81.91,26.04 | 81.91,26.04 81.28,26.67 | 81.28,26.67 80.64,27.3 | 80.64,27.3 80.52,27.43 80.01,27.43 79.38,26.8 79.38,26.04 | 72.39,20.32 LED1.K 73.66,22.86 | 74.93,20.32 76.2,20.32 | 76.2,20.32 78.74,20.32 | 78.74,20.32 80.01,20.32 | 80.01,20.32 81.28,20.32 | 73.66,22.86 73.66,21.59 | 72.39,20.32 73.66,21.59 | 81.28,26.67 80.01,25.4 | D1.A 80.64,27.3 | X2.3 78.74,7.68 | 78.74,7.68 78.74,8.81 | 78.74,7.68 78.74,7.62 | 78.74,6.35 77.47,5.08 | X2.3 77.39,6.43 76.2,7.62 | 76.2,7.62 77.31,7.62 | 77.31,7.62 77.39,7.54 | 76.2,8.89 77.31,7.78 77.31,7.62 | 78.74,8.81 78.74,8.89 83.19,13.34 | 78.74,8.81 77.47,7.54 | X2.3 77.39,5.16 77.47,5.08 | X2.3 76.22,6.33 76.2,6.35 | X2.3 77.39,6.27 76.2,5.08 | 80.01,5.08 80.64,5.71 | 80.64,5.71 80.64,6.35 | 80.64,6.35 80.64,9.53 | 80.01,8.89 80.01,7.62 | 80.01,7.62 80.01,6.35 78.74,5.08 | 79.38,8.26 79.38,6.99 78.74,6.35 | v85.09,35.56 84.48,36.17 81.28,36.17 | 81.28,36.17 79.4,36.17 78.74,36.83 | 78.31,38.94 78.31,41.91 Q1.2 79.17,41.91 79.17,38.53 | 78.31,38.94 78.31,37.26 78.74,36.83 | 79.17,38.53 78.74,38.1
  Bottom 1.016: 79.17,38.53 79.81,37.9 | 79.81,37.9 80.44,37.26 | 80.44,37.26 81.28,36.42 81.28,36.17 | v85.09,35.56 84.07,34.54 73.41,34.54 72.39,35.56 74.93,35.56 | 74.93,35.56 75.56,36.2 | 75.56,36.2 76.2,36.83 | 76.2,36.83 77.27,37.9 | 77.27,37.9 78.31,38.94 | v85.09,35.56 78.74,35.56 | 78.74,35.56 74.93,35.56 | 80.44,37.26 80.01,36.83 78.74,36.83 | 78.74,36.83 77.47,36.83 | 77.47,36.83 76.2,36.83 | 78.74,36.83 78.1,36.2 | 78.1,36.2 75.56,36.2 | 79.81,37.9 77.27,37.9 | 79.17,38.53 79.17,37.26 78.74,36.83 | 78.74,35.56 78.1,36.2 | 77.27,37.9 77.27,37.03 77.47,36.83 | 81.28,20.32 82.55,19.05 | 82.55,19.05 82.55,17.78 | 82.55,15.24 82.55,13.97 | 82.55,13.97 81.28,12.7 | 81.28,12.7 80.01,12.7 | 80.01,12.7 78.74,12.7 | 83.82,13.97 83.82,12.7 | 83.82,12.7 83.19,12.06 | 83.19,12.06 82.55,11.43 | 82.55,11.43 81.91,10.79 | 81.6,10.48 80.64,9.53 | 83.19,13.34 83.82,13.97 | 83.82,19.05 83.19,19.68 | 83.19,19.68 82.55,20.32 | 83.82,17.78 83.82,15.24 | 83.82,15.24 83.82,13.97 | 83.82,13.97 82.55,15.24 | 82.55,15.24 82.55,16.51 | 82.55,16.51 82.55,17.78 | 83.82,16.51 82.55,17.78 | 83.82,15.24 82.55,16.51 | 83.82,17.78 82.55,19.05 | 83.82,17.78 83.82,19.05 | 83.82,19.05 83.82,21.59 | 83.82,21.59 83.82,22.86 | 83.82,22.86 84.45,23.5 | 82.55,21.59 82.55,22.86 | 82.55,22.86 83.82,24.13 | 82.55,20.32 82.55,21.59 | 82.55,21.59 83.82,22.86 | 82.55,20.32 83.19,20.95 | 81.28,25.4 82.55,24.13 | 84.45,23.5 80.64,23.5 80.01,24.13 | 80.01,24.13 79.38,24.77 | 79.38,24.77 78.74,25.4 | 80.01,25.4 79.38,24.77 | 80.64,24.77 81.28,25.4 | 81.91,26.04 81.28,25.4 | 81.28,22.86 76.2,22.86 | 74.93,20.32 73.66,20.32 | 73.66,20.32 72.39,20.32 | 79.38,24.77 76.2,21.59 | 76.2,21.59 74.93,20.32 | 73.66,21.59 74.93,20.32
  Bottom 1.016: 73.66,20.32 74.93,21.59 | 74.93,21.59 76.2,21.59 | 76.2,20.32 76.83,20.95 | 76.83,20.95 80.01,24.13 | 81.28,24.13 78.1,20.95 76.83,20.95 | 78.74,20.32 81.28,22.86 | 81.28,22.86 82.55,22.86 | 82.55,22.86 81.28,21.59 | 81.28,21.59 80.01,20.32 | 82.55,20.32 81.28,21.59 | 82.55,21.59 81.28,21.59 | 81.28,20.32 81.28,21.59 | 73.66,22.86 76.2,22.86 | 73.66,21.59 74.3,22.23 75.56,22.23 | 83.82,21.59 83.19,20.95 | 83.19,20.95 83.19,19.68 | 82.55,13.97 83.19,13.34 | 76.2,8.89 78.74,11.43 | 78.74,11.43 80.01,11.43 | 80.01,11.43 81.28,12.7 | 80.01,11.43 76.2,7.62 | 80.01,11.43 78.74,12.7 | 78.74,11.43 80.01,12.7 | 76.2,5.08 76.2,3.81 | 76.2,3.81 76.2,2.54 77.22,1.52 77.47,1.52 | 90.17,3.81 90.17,2.54 89.15,1.52 85.09,1.52 | 90.17,3.81 90.17,7.62 89.53,8.26 | 89.53,8.26 88.9,8.89 87.63,8.89 | 85.09,8.89 84.45,9.53 | 84.45,9.53 83.82,10.16 | 83.82,10.16 83.82,12.7 | 77.47,1.52 78.74,1.52 | 78.74,1.52 80.01,1.52 | 80.01,1.52 81.28,1.52 | 81.28,1.52 83.82,1.52 | 83.82,1.52 85.09,1.52 | 83.19,12.06 83.19,10.16 | 83.19,10.16 83.19,8.89 | 83.19,8.89 83.19,7.62 | 83.19,7.62 83.19,5.71 | 83.19,5.71 83.19,5.08 | 83.19,5.08 83.19,3.81 | 83.19,3.81 83.19,2.16 83.82,1.52 | 83.82,10.16 83.82,7.62 | 85.09,8.89 84.45,8.26 | 84.45,8.26 83.82,7.62 | 83.82,7.62 83.82,6.35 | 83.82,6.35 83.82,5.08 | 83.82,5.08 83.82,3.81 | 83.82,3.81 83.82,2.54 82.3,2.54 81.28,1.52 | 85.09,8.89 85.09,7.62 | 85.09,7.62 85.09,6.35 | 85.09,6.35 85.09,5.08 | 85.09,5.08 85.09,3.81 | 85.09,3.81 85.09,2.54 | 85.09,2.54 86.36,2.54 | 86.36,2.54 87.63,2.54 | 87.63,2.54 88.9,2.54 | 88.9,7.62 88.27,8.26 | 88.27,8.26 87.63,8.89 | 87.63,8.89 86.36,8.89 | 86.36,8.89 85.09,8.89 | 88.9,2.54 88.9,3.81 | 88.9,3.81 88.9,5.08 | 88.9,6.35 88.9,7.62
  Bottom 1.016: 89.53,8.26 89.53,4.45 88.9,3.81 | 90.17,3.81 88.9,2.54 | 88.9,3.81 87.63,2.54 | 88.9,6.35 88.9,5.08 | 88.9,5.08 86.36,2.54 | 88.9,6.35 85.09,2.54 | 88.9,7.62 85.09,3.81 | 86.36,6.35 85.09,5.08 | 88.27,8.26 86.99,6.99 | 86.99,6.99 86.36,6.35 | 86.36,6.35 85.09,6.35 | 87.63,8.89 86.36,7.62 | 86.36,7.62 85.09,7.62 | 86.36,8.89 86.36,6.35 | 86.36,7.62 85.09,8.89 | 86.99,6.99 85.72,6.99 85.09,6.35 | 85.09,7.62 83.82,6.35 | 85.09,6.35 84.45,5.71 | 84.45,5.71 83.82,5.08 | 85.09,3.81 83.82,3.81 | 84.45,8.26 84.45,9.53 | 85.09,5.08 83.82,5.08 | 84.45,5.71 84.45,2.16 85.09,1.52 | 83.19,10.16 82.55,10.16 | 82.55,10.16 82.55,11.43 | 81.91,10.79 82.55,10.16 | 83.19,10.16 81.6,8.57 | 81.6,8.57 80.64,7.62 80.01,7.62 | 81.91,10.79 81.6,10.48 | 81.6,10.48 81.6,8.57 | 83.19,8.89 80.64,6.35 | 83.19,7.62 82.23,6.67 | 82.23,6.67 81.28,5.71 80.64,5.71 | 83.82,6.35 83.19,5.71 | 83.19,5.71 82.55,5.08 | 82.55,5.08 81.28,5.08 | 81.28,5.08 80.01,5.08 | 82.23,6.67 82.23,6.29 77.47,1.52 | 83.19,5.71 81.91,5.71 81.28,5.08 | 81.28,5.08 78.74,2.54 | 78.74,2.54 78.99,2.54 80.01,1.52 | 84.45,5.71 82.93,5.71 82.42,5.21 | 82.42,5.21 79.88,2.67 | 79.88,2.67 79.25,2.03 | 79.25,2.03 78.74,1.52 | 83.82,5.08 82.55,3.81 | 82.55,3.81 81.28,2.54 | 81.28,2.54 80.77,2.03 79.25,2.03 | 83.19,3.81 81.28,1.91 81.28,1.52 | 83.82,5.08 83.19,5.08 | 82.55,5.08 82.42,5.21 | 83.19,3.81 82.55,3.81 | 82.55,3.81 81.28,3.81 | 81.28,3.81 78.74,3.81 | 78.74,3.81 76.2,3.81 | 80.01,5.08 78.74,5.08 | 83.19,5.08 82.55,5.08 | 80.01,5.08 78.74,3.81 | 81.28,5.08 82.55,3.81 | 82.55,5.08 82.55,3.81 | 81.28,3.81 81.28,2.54 | 81.28,2.54 80.01,2.54 79.88,2.67 | 78.74,2.54 78.74,5.08 | 78.74,2.54 77.47,3.81 | 77.47,3.81 77.47,5.08 | 78.74,5.08 77.47,3.81
  Bottom 1.016: 77.47,3.81 77.47,2.54 76.2,3.81 | 77.47,3.81 76.2,5.08
OP2  (via drill 0.35)
  Top 1.016: v66.04,34.29 v66.04,25.4 | v66.04,20.32 v66.04,12.7
  Bottom 1.016: 55.88,21.59 57.15,21.59 | 57.15,21.59 58.42,21.59 62.23,25.4 | 62.23,25.4 D2.A | 66.04,22.86 66.04,21.59 | 66.04,21.59 v66.04,20.32 55.88,20.32 | 66.04,22.86 64.77,22.86 | 64.77,22.86 63.5,24.13 | 63.5,24.13 62.87,24.77 | 62.87,24.77 62.23,25.4 | X2.1 67.31,6.25 67.31,5.08 | 67.31,5.08 68.58,6.35 | 68.58,6.35 66.04,6.35 | 66.04,6.35 67.31,5.08 | 66.04,6.35 66.04,7.68 | 66.04,11.43 v66.04,12.7 | X2.1 66.7,7.01 | 66.7,7.01 66.04,7.68 | v66.04,12.7 67.31,12.7 | 67.31,12.7 66.04,11.43 | 66.04,11.43 66.04,10.16 | 66.04,10.16 66.04,8.89 | 66.04,8.89 66.04,7.68 | 68.58,6.35 68.58,7.62 | 68.58,7.62 68.58,8.89 | 68.58,8.89 68.58,10.16 | 68.58,10.16 68.58,11.43 | 68.58,11.43 67.94,12.06 | 67.94,12.06 67.31,12.7 | 67.94,12.06 66.04,10.16 | 68.58,11.43 66.04,8.89 | 68.58,10.16 68.52,10.16 66.04,7.68 | 68.58,8.89 67.31,7.62 | 67.31,7.62 66.7,7.01 | X2.1 67.31,6.41 67.31,7.62 | X2.1 67.39,6.43 68.58,7.62 | 63.5,12.7 62.23,12.7 66.04,8.89 | 63.5,12.7 64.77,12.7 | 64.77,12.7 v66.04,12.7 | 66.04,10.16 63.5,12.7 | 64.77,12.7 66.04,11.43 | 54.61,20.32 LED4.K 55.88,21.59 | D2.A 64.77,26.67 | 64.77,26.67 66.04,26.67 | 66.04,26.67 67.31,26.67 v66.04,25.4 | v66.04,25.4 66.04,24.13 | 66.04,24.13 66.04,22.86 | 57.15,21.59 56.52,20.95 | 55.88,20.32 54.61,20.32 | 56.52,20.95 55.88,21.59 | 56.52,20.95 55.88,20.32 | 55.88,20.32 55.88,21.59 | 55.88,21.59 54.61,20.32 | 62.87,24.77 59.05,20.95 | 59.05,20.95 56.52,20.95 | 63.5,24.13 60.96,21.59 | 60.96,21.59 60.33,20.95 | 60.33,20.95 59.05,20.95 | 64.77,22.86 62.87,20.95 | 62.87,20.95 60.33,20.95 | 63.5,24.13 63.5,22.86 | 63.5,22.86 62.23,21.59 60.96,21.59 | 66.04,22.86 64.14,20.95 | 64.14,20.95 62.87,20.95 | 66.04,21.59 65.41,20.95 64.14,20.95
  Bottom 1.016: 64.14,24.77 63.5,24.13 | 66.04,26.67 64.14,24.77 | 64.14,24.77 62.87,24.77 | 64.77,26.67 64.14,26.04 | 64.14,26.04 63.5,25.4 62.23,25.4 | 64.14,26.04 62.87,26.04 D2.A | v66.04,25.4 64.77,24.13 | 64.77,24.13 64.77,22.86 | 64.77,24.13 66.04,22.86 | Q2.2 59.26,41.91 59.26,38.1 56.72,35.56 55.88,35.56 | 62.23,33.02 63.5,33.02 | Q2.2 60.12,41.91 60.12,41.48 | Q2.2 60.12,41.48 | 60.12,41.48 60.12,38.1 | 60.12,38.1 60.12,37.26 63.09,34.29 64.77,34.29 | 62.23,33.02 62.23,34.29 | 59.69,36.83 62.23,34.29 | 62.23,34.29 63.5,33.02 | 63.5,33.02 64.14,33.66 | 64.14,33.66 64.77,34.29 | 64.77,34.29 v66.04,34.29 66.67,33.66 | 64.77,33.02 63.5,33.02 | 66.67,33.66 65.41,33.66 64.77,33.02 | 64.77,33.02 67.31,33.02 66.67,33.66 | 58.42,33.02 57.15,33.02 55.88,34.29 | 58.42,33.02 59.69,33.02 | 59.69,33.02 60.96,33.02 | 60.96,33.02 62.23,33.02 | 55.88,35.56 54.61,35.56 55.88,34.29 | 60.12,38.1 58.64,36.61 | 58.64,36.61 58,35.98 | 58,35.98 57.37,35.34 | 57.37,35.34 56.31,34.29 55.88,34.29 | 55.88,35.56 58.42,33.02 | 57.37,35.34 59.69,33.02 | 58,35.98 60.96,33.02 | 58.64,36.61 62.23,33.02 | 62.23,34.29 63.5,34.29 64.14,33.66 | 66.04,24.13 64.77,24.13 | 64.14,24.77 64.14,23.5 63.5,22.86
OP3  (via drill 0.35)
  Top 1.016: v48.26,33.02 v48.26,25.4 | v48.26,20.32 v48.26,12.7
  Bottom 1.016: 41.91,22.86 40.64,21.59 LED5.K 38.1,20.32 | 41.91,22.86 44.45,25.4 D3.A 45.72,26.67 | 43.18,33.02 v48.26,33.02 | 48.26,22.86 v48.26,25.4 49.53,26.67 45.72,26.67 | 48.26,22.86 v48.26,20.32 39.37,20.32 | 60.96,8.89 57.15,12.7 v48.26,12.7 48.9,13.34 57.79,13.34 63.5,7.62 | 60.96,8.89 62.23,7.62 62.23,6.35 62.17,6.35 X3.3 | 48.26,22.86 41.91,22.86 | 41.07,38.1 41.07,41.91 Q3.2 40.21,41.91 40.21,37.67 | 41.07,38.1 41.07,35.13 41.91,34.29 | 41.91,34.29 43.18,33.02 | 40.21,37.67 40.21,34.72 41.91,33.02 43.18,33.02 | 41.91,34.29 44.88,34.29 | 44.88,34.29 48.26,34.29 49.53,33.02 49.53,31.75 36.83,31.75 35.56,33.02 | 40.21,37.67 38.1,35.56 36.83,35.56 | 41.07,38.1 44.88,34.29 | 34.29,35.56 33.02,36.83 31.75,36.83 35.56,33.02 | 34.29,35.56 35.56,35.56 | 35.56,35.56 36.83,35.56 | 34.29,35.56 35.56,34.29 | 35.56,35.56 36.83,34.29 | X3.3 62.13,6.35 60.96,6.35 | 60.96,6.35 62.23,5.08 63.5,6.35 63.5,7.62 | 60.96,6.35 60.96,7.62 | 60.96,7.62 60.96,8.89 | X3.3 62.15,6.43 60.96,7.62 | X3.3 63.44,7.62 63.5,7.62 | 38.1,20.32 36.83,20.32 | 38.1,20.32 39.37,20.32 | 39.37,20.32 45.72,26.67 | 35.56,34.29 36.83,35.56 | 35.56,33.02 35.56,34.29
  pour Bottom: 40.64,38.1 35.56,33.02 36.83,31.75 49.53,31.75 49.53,33.02 48.26,34.29 44.45,34.29
  pour Bottom: 36.83,21.59 40.64,21.59 44.45,25.4 44.45,26.67 49.53,26.67 48.26,25.4 48.26,20.32 36.83,20.32
OP4  (via drill 0.35)
  Top 1.016: v30.48,20.32 v30.48,13.97
  Bottom 1.016: D4.A 22.46,22.46 | 22.46,22.46 21.59,21.59 20.32,21.59 | 20.32,21.59 LED6.K 20.32,20.32 | D4.A 27.3,26.04 | 27.3,26.04 27.94,25.4 | 27.94,25.4 28.57,24.77 | 28.57,24.77 29.21,24.13 | 29.21,24.13 29.84,23.5 29.84,21.59 | 46.99,10.16 48.26,10.16 | 48.26,10.16 48.9,9.53 | 48.9,9.53 50.8,7.62 | 21.59,40.64 Q4.2 22.02,41.91 22.02,37.67 | 21.59,39.37 21.59,38.1 | 21.59,38.1 21.59,36.83 | 21.59,36.83 21.59,35.56 | 21.59,35.56 21.59,34.29 | 21.59,33.02 22.86,31.75 | 26.67,27.94 22.86,31.75 | 22.86,31.75 21.59,31.75 | 21.59,40.64 21.59,39.37 | 21.59,33.02 21.59,31.75 | 21.16,41.07 21.59,40.64 | 21.16,41.91 21.16,41.07 | 21.59,31.75 D4.A | 22.02,37.67 22.02,32.59 30.48,24.13 | 31.75,21.59 31.75,22.86 30.48,24.13 | 31.75,21.59 31.75,20.32 | 31.75,20.32 v30.48,20.32 | v30.48,20.32 29.21,20.32 | 29.21,20.32 29.21,21.59 | 29.21,21.59 29.21,22.86 | 29.21,22.86 29.21,24.13 | 29.84,21.59 29.84,20.95 | 29.84,20.95 v30.48,20.32 | 30.48,24.13 30.48,22.86 | 30.48,22.86 30.48,21.59 | 30.48,21.59 29.84,20.95 | v30.48,20.32 30.48,21.59 | 30.48,21.59 31.75,21.59 | 30.48,21.59 31.75,20.32 | 30.48,22.86 31.75,21.59 | 29.21,20.32 22.86,20.32 | 22.86,20.32 21.59,20.32 | 21.59,20.32 20.32,20.32 | 20.32,20.32 19.05,20.32 19.05,22.06 19.45,22.46 22.46,22.46 | 27.3,26.04 24.13,22.86 | 24.13,22.86 22.22,20.95 | 22.22,20.95 21.59,20.32 | 21.59,20.32 20.95,20.95 | 20.95,20.95 20.32,21.59 | 22.86,20.32 23.5,20.95 | 23.5,20.95 27.94,25.4 | 28.57,24.77 24.77,20.95 | 24.77,20.95 23.5,20.95 | 29.21,24.13 26.67,21.59 | 26.67,21.59 26.04,20.95 | 26.04,20.95 24.77,20.95 | 29.21,22.86 27.94,21.59 | 27.94,21.59 27.3,20.95 | 27.3,20.95 26.04,20.95 | 29.84,21.59 29.21,20.95 27.3,20.95 | 29.21,21.59 27.94,21.59
  Bottom 1.016: 21.59,39.37 24.13,36.83 24.13,35.56 22.86,36.83 | 22.86,36.83 22.02,37.67 | 22.86,36.83 22.86,35.56 | 50.82,6.33 X3.1 | 50.8,7.62 50.8,6.35 50.82,6.33 | 50.8,7.62 52.07,7.62 | 52.07,7.62 53.34,7.62 | 53.34,7.52 53.34,6.35 | 53.34,6.35 52.07,5.08 50.9,5.08 | 50.82,6.33 50.82,5.1 50.8,5.08 50.9,5.08 | X3.1 50.9,5.08 | X3.1 52.07,6.41 | 52.07,6.41 52.07,7.62 | X3.1 52.17,6.35 53.34,6.35 | X3.1 53.34,7.52 | 53.34,7.52 53.34,7.62 | 50.8,7.62 52.07,6.35 52.07,6.41 | 43.18,13.97 v30.48,13.97 34.29,10.16 44.45,10.16 | 43.18,13.97 45.72,11.43 | 46.99,10.16 44.45,10.16 | X3.1 52.15,6.43 53.34,7.62 | 53.34,7.62 53.34,8.89 52.07,10.16 | 52.07,10.16 48.26,10.16 | 50.17,9.53 51.44,9.53 53.34,7.62 | X3.1 50.8,7.68 50.8,8.89 | 50.8,8.89 50.17,9.53 | 50.17,9.53 48.9,9.53 | 50.8,8.89 52.07,7.62 | 47.62,10.79 46.36,10.79 | 46.99,10.16 46.36,10.79 | 46.36,10.79 45.72,11.43 | 45.72,11.43 43.18,11.43 | 45.72,11.43 46.99,11.43 | 46.99,11.43 47.62,10.79 | 47.62,10.79 48.26,10.16 | 47.62,10.79 51.44,10.79 52.07,10.16 | 46.99,10.16 47.62,9.53 | 47.62,9.53 48.9,9.53 | 47.62,9.53 45.09,9.53 44.45,10.16 | 46.99,11.43 44.45,13.97 43.18,13.97 | 22.22,20.95 20.95,20.95 | 24.13,22.86 25.4,21.59 26.67,21.59 | 19.05,36.83 19.05,35.56 | 19.05,35.56 19.05,34.29 21.59,31.75 | 21.16,41.07 21.16,38.94 20.32,38.1 | 20.32,38.1 19.05,36.83 | 20.32,35.56 20.32,36.83 | 20.32,36.83 20.32,38.1 | 19.05,36.83 20.32,35.56 | 20.32,35.56 21.59,34.29 | 21.59,34.29 21.59,33.02 | 19.05,36.83 20.32,36.83 | 20.32,36.83 21.59,36.83 | 20.32,38.1 21.59,36.83 | 20.32,35.56 21.59,35.56 | 21.59,38.1 20.32,38.1 | 21.59,35.56 20.32,36.83 | 19.05,35.56 21.59,33.02
  pour Bottom: 21.59,35.56 24.13,35.56 33.02,26.67 33.02,25.4 31.75,24.13 31.75,22.86 21.59,33.02
  pour Bottom: 30.48,13.97 43.18,13.97 46.99,10.16 34.29,10.16
V+
  Bottom 1.016: X1.2 6.39,24.13 | X1.2 7.62,24.09 | 7.62,24.09 7.7,24.09 | 8.89,24.09 10.16,24.09 | 10.16,24.09 11.47,24.09 12.06,23.5 | 12.06,23.5 R1.1 | R10.2 D4.C | D4.C R8.2 D3.C D2.C | R6.2 D2.C | D2.C R3.2 D1.C 80.77,16.51 | R10.2 15.24,16.51 14.73,17.02 | R10.2 22.86,15.24 | R1.1 12.7,25.4 | 11.43,27.94 12.06,28.57 10.16,28.57 | 11.43,26.67 11.43,25.4 | 11.43,25.4 11.43,24.13 | 11.43,24.13 11.43,22.86 | 12.06,23.5 12.06,22.23 11.43,22.86 | 12.7,27.94 12.06,27.3 12.06,23.5 | 11.43,27.94 10.16,27.94 | 10.16,27.94 8.89,27.94 | 8.89,27.94 8.26,28.57 | 10.16,27.94 9.53,28.57 | 8.26,28.57 8.26,27.94 | 8.26,27.94 8.26,26.67 | 8.26,26.67 8.26,24.73 | 8.26,24.73 7.66,24.13 | 7.66,24.13 7.62,24.09 | 8.89,24.09 8.89,25.36 | 8.89,26.67 8.89,27.94 | 10.16,27.94 8.89,26.67 | 8.89,26.67 8.89,25.4 | 8.89,25.4 8.89,25.36 | 8.89,25.36 10.16,24.09 | 11.43,26.67 11.43,27.94 | 10.16,24.13 10.16,25.4 | 10.16,26.67 10.16,25.4 | 11.43,27.94 10.16,26.67 | 11.43,25.4 10.16,25.4 | 10.16,25.4 8.89,25.4 | 8.89,26.67 10.16,25.4 | 11.43,26.67 10.16,25.4 | 11.43,24.13 10.16,25.4 | X1.2 5.12,25.36 | 5.12,25.36 5.08,25.4 5.08,24.13 5.12,24.13 | 5.71,24.13 7.66,24.13 | 10.92,23.37 11.43,22.86 | 13.21,17.53 12.7,19.05 14.73,17.02 | 13.21,17.53 13.59,16.38 | 13.59,16.38 13.97,15.24 | 13.97,15.24 15.24,15.24 | 15.24,15.24 16.51,15.24 | 16.51,15.24 17.78,15.24 | 17.78,15.24 19.05,15.24 | 19.05,15.24 20.32,15.24 | 20.32,15.24 21.59,15.24 | 21.59,15.24 22.86,15.24 | R10.2 22.22,15.88 | 22.22,15.88 21.59,15.24 | 22.22,15.88 14.61,15.88 | 11.43,20.32 10.16,22.86 10.12,22.86 8.89,24.09 | 11.43,20.32 12.19,18.8 | 12.19,18.8 13.97,15.24 | 28.59,15.86 28.57,15.88 27.94,15.24 27.94,12.7 33.02,7.62 43.18,7.62 44.45,6.35 44.45,2.54 43.43,1.52 25.15,1.52
  Bottom 1.016: 28.45,17.02 16.51,17.02 | 16.51,17.02 14.73,17.02 | 28.59,15.86 23.51,15.86 R10.2 | D4.C 26.67,15.24 28.45,17.02 | 80.77,16.51 80.26,17.02 28.45,17.02 | 80.77,16.51 80.12,15.86 76.82,15.86 | 76.82,15.86 74.93,15.86 | 74.93,15.86 69.85,15.86 | 69.85,15.86 68.58,15.86 | 68.58,15.86 28.59,15.86 | 68.58,15.86 71.74,12.7 72.39,12.7 | 72.39,12.7 73.66,12.7 76.2,15.24 | 76.2,15.24 76.82,15.86 | 74.93,15.86 75.55,15.24 76.2,15.24 | 74.93,15.86 74.93,15.24 74.3,14.61 | 74.3,14.61 73.66,13.97 | 73.66,13.97 72.39,12.7 | 72.39,12.7 69.85,15.24 69.85,15.86 | 69.85,15.86 70.8,14.92 | 70.8,14.92 71.74,13.97 73.66,13.97 | 74.3,14.61 73.98,14.92 70.8,14.92 | 13.97,15.24 15.88,13.34 | 15.88,13.34 17.14,12.06 | 17.14,12.06 17.78,11.43 | 17.78,11.43 20.32,11.43 22.86,8.89 | 26.67,5.08 27.94,5.08 27.94,3.81 26.67,5.08 | 22.86,8.89 26.67,5.08 | 22.86,8.89 22.86,10.16 | 22.86,10.16 22.86,11.43 | 22.86,11.43 22.86,12.7 | 22.86,12.7 22.86,13.97 | 22.86,13.97 22.86,15.24 | 24.13,5.08 24.13,3.81 | 24.13,3.81 24.13,2.54 25.15,1.52 | 25.4,3.81 25.4,5.08 | 24.13,5.08 25.4,3.81 | 25.4,3.81 25.4,2.54 | 25.4,2.54 24.13,3.81 | 25.4,2.54 26.67,2.54 | 26.67,2.54 27.94,2.54 | 25.4,3.81 26.67,2.54 | 22.86,10.16 20.95,12.06 | 20.95,12.06 20.32,12.7 | 20.32,12.7 19.05,12.7 | 19.05,12.7 17.78,12.7 15.24,15.24 | 16.51,15.24 19.05,12.7 | 17.78,15.24 20.32,12.7 | 19.05,15.24 22.86,11.43 | 22.86,12.7 20.95,14.61 | 20.95,14.61 20.32,15.24 | 22.86,13.97 22.22,14.61 20.95,14.61 | 20.95,12.06 17.14,12.06 | 10.16,28.57 9.53,28.57 | 5.12,25.36 5.12,25.44 5.71,26.04 5.71,28.57 C4.1 | 12.7,27.94 11.43,29.21 C4.1 | 12.7,25.4 13.97,26.67 | 13.97,26.67 15.24,26.67 16.51,27.94 16.51,29.21 | 16.51,29.21 15.24,29.21
  Bottom 1.016: 15.24,29.21 13.97,29.21 | 13.97,29.21 12.7,29.21 | 12.7,29.21 10.79,29.21 10.16,28.57 | 13.97,29.21 12.7,27.94 | 12.7,27.94 12.7,26.67 | 12.7,26.67 12.7,25.4 | C1.+ 13.97,26.67 | 16.51,29.21 C1.+ | 13.97,26.67 12.7,26.67 | C1.+ 13.97,29.21 | 13.97,27.94 12.7,27.94 | 13.97,26.67 12.7,27.94 | 13.97,29.21 13.97,27.94 | 13.97,26.67 13.97,27.94 | C1.+ 13.97,27.94 | 13.97,27.94 12.7,29.21 | C1.+ 15.24,29.21 | 10.16,26.67 8.89,26.67 | X1.2 6.35,26.67 | 6.35,26.67 6.35,27.94 | 6.35,27.94 C4.1 | 9.53,28.57 8.26,28.57 | 8.26,28.57 8.89,29.21 | 8.26,28.57 6.98,28.57 6.35,27.94 | 8.26,27.94 7.62,27.94 6.98,27.3 | 6.98,27.3 6.35,26.67 | X1.2 6.98,26 6.98,26.67 | 6.98,26.67 6.98,27.3 | 8.26,27.94 6.98,26.67 | 8.89,26.67 8.26,26.67 | 8.26,26.67 6.98,26.67 | 8.26,26.67 5.71,24.13 | 5.71,24.13 5.12,24.13 | X1.2 7.62,25.36 8.26,24.73 | X1.2 5.12,24.13 | 7.66,24.13 7.7,24.09 | 7.7,24.09 8.89,24.09 | 10.16,24.09 10.16,19.05 | 10.16,19.05 10.16,17.78 11.43,16.51 | 11.43,16.51 12.7,16.51 | 12.7,16.51 14.17,16.51 | 14.17,16.51 14.3,16.64 | 14.17,16.51 13.97,16.31 13.97,15.24 | 11.43,16.51 12.7,15.24 13.97,15.24 | 13.97,15.24 12.7,16.51 | 13.59,16.38 10.92,19.05 | 10.92,19.05 10.16,19.05 | 12.7,16.51 10.16,19.05 | 10.92,19.05 10.92,21.59 | 10.92,21.59 10.92,22.86 | 10.92,22.86 10.92,23.37 | 10.92,23.37 10.81,23.48 | 12.19,18.8 12.19,20.32 | 12.19,20.32 12.19,21.59 10.92,22.86 | 11.43,20.32 11.43,21.08 10.92,21.59 | R1.1 12.7,20.83 15.49,18.03 | 15.49,18.03 16.51,17.02 | 15.49,18.03 14.48,18.03 12.19,20.32 | 14.17,16.51 14.17,16.57 13.21,17.53 | 17.78,1.52 11.18,1.52 10.16,2.54 10.16,5.08 15.88,10.79 | 17.78,1.52 25.15,1.52 | 17.78,11.43 17.78,1.52 | 15.88,10.79 15.88,13.34 | 17.14,12.06 15.88,10.79
  Bottom 1.016: 22.86,7.62 22.86,6.35 24.13,5.08
  pour Bottom: 22.86,16.51 27.94,16.51 27.94,12.7 33.02,7.62 43.18,7.62 44.45,6.35 44.45,2.54 27.94,2.54 24.13,6.35 24.13,8.89 22.86,10.16
  pour Bottom: 10.16,5.08 16.51,11.43 17.78,11.43 22.86,11.43 24.13,10.16 25.4,8.89 25.4,2.54 11.43,2.54 10.16,3.81
VCC
  Bottom 1.016: R4.1 C3.1 86.36,20.32 C2.+ 86.61,23.11 J1.9 J1.7